# EAGLE design displayBoard (EAGLE 9.6.2)
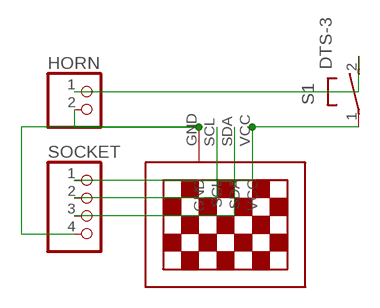
[diagram p0: schematic, sheet 1]

## Parts
HORN  PINHD-1X2  [1X02]
S1  DTS-3  [DTS-3]
SOCKET  PINHD-1X4  [1X04]
U$1  13"OLED13"OLED  [1.3"OLED]

## Nets
N$1: HORN.1 S1.2
N$2: S1.1 SOCKET.1 U$1.VCC
N$3: HORN.2 SOCKET.4 U$1.GND
N$4: SOCKET.2 U$1.SCL
N$5: SOCKET.3 U$1.SDA

## Library data of the parts
HORN = pinhead:PINHD-1X2: PIN HEADER
S1 = switch-tact:DTS-3
SOCKET = pinhead:PINHD-1X4: PIN HEADER
U$1 = OLED:13"OLED

## Board
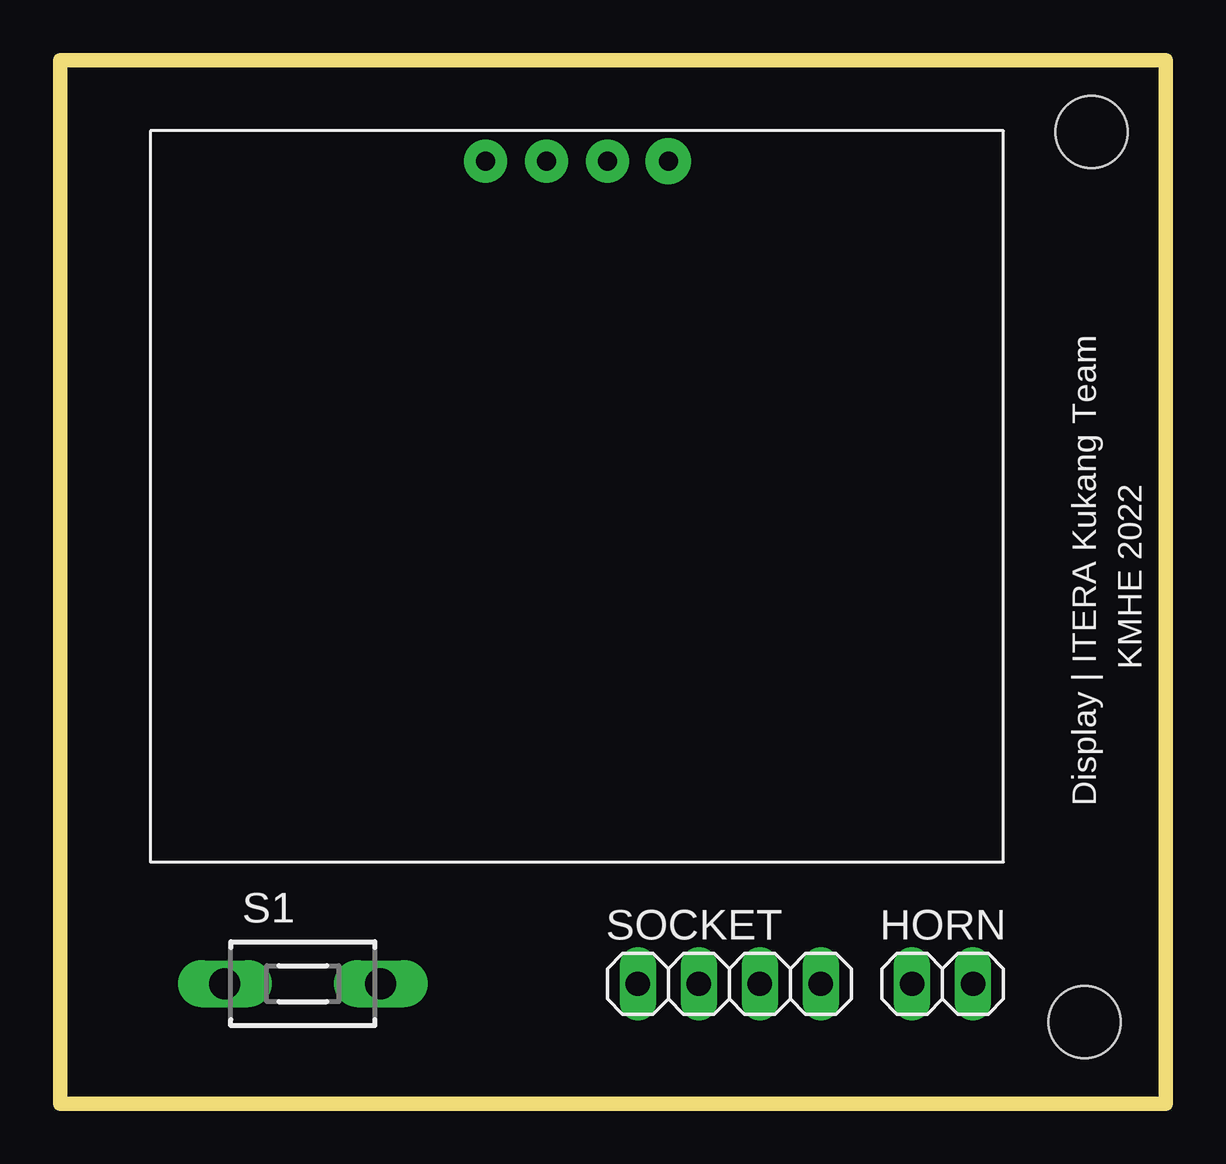
[diagram p1: board, top side]
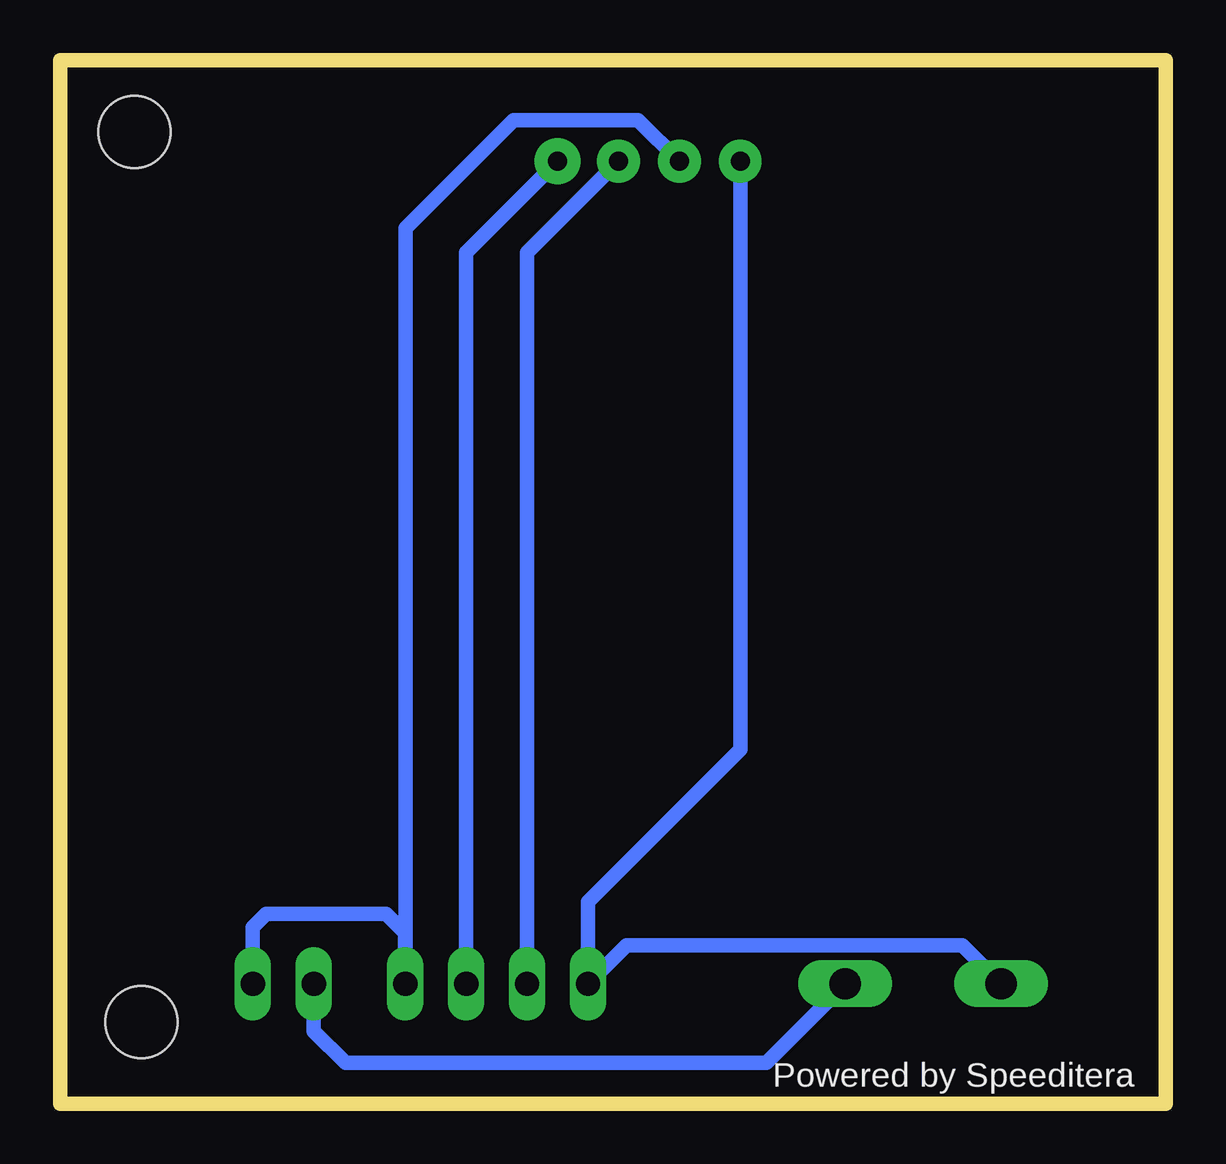
[diagram p2: board, bottom side, seen from below]

Size 46.1 x 43.5 mm. Coordinates in mm from the lower left corner, seen from the top.
Outline: 46.1,0 0,0 0,43.5 46.1,43.5 46.1,0
Copper layers (1*16): Top 0.035mm / dielectric 1.5mm / Bottom 0.035mm
Design rules "default": minimum track width 6mil, minimum drill 0.35mm, track to track 6mil, track to pad 6mil, pad to pad 6mil, via to via 6mil, smd to smd 6mil, copper to edge 40mil, drill to drill 6mil, minimum pad ring 10mil, minimum via ring 8mil, stop-mask expansion 4mil, vias tented up to drill 0mil, thermal gap 10mil
Holes 3 mm at 43,40.5 42.7,3.4

### Footprints (pad centres in the part's own frame; a part is rotated, then mirrored left to right if it is on the bottom)
1X02 = drill 1.016 long: 1 -1.27,0; 2 1.27,0
DTS-3 = drill 1.3 long: 1 -3.25,0; 2 3.25,0
1X04 = drill 1.016 long: 1 -3.81,0; 2 -1.27,0; 3 1.27,0; 4 3.81,0
1.3"OLED = drill 0.8 pad 1.778: GND 2.54,0; SCL 5.08,0; VCC 0,0 | drill 0.8 pad 1.9: SDA 7.62,0

### Placement (x,y rotation side)
HORN  36.79,4.99 0 top
S1  10.12,4.99 0 top
SOCKET  27.9,4.99 0 top
U$1  17.74,39.28 0 top

### Tracks (layer width: path | path; a pad name or v marks a point on that pad's centre or on a via)
N$1
  Bottom 0.61: S1.2 16.66,1.7 34.2,1.7 35.52,3.02 HORN.1
N$2
  Bottom 0.61: U$1.VCC 17.74,14.76 24.09,8.41 SOCKET.1 22.48,6.6 8.48,6.6 S1.1
N$3
  Bottom 0.61: HORN.2 38.06,7.34 37.5,7.9 32.5,7.9 31.71,7.11 SOCKET.4 31.7,36.5 27.2,41 22,41 U$1.GND
N$4
  Bottom 0.61: SOCKET.2 26.63,35.47 U$1.SCL
N$5
  Bottom 0.61: SOCKET.3 29.17,35.47 U$1.SDA

### Text on the board
tNames: KMHE 2022 | Display | ITERA Kukang Team
bNames: Powered by Speeditera